# EAGLE board epnet (EAGLE 7.2.0)
EPNET
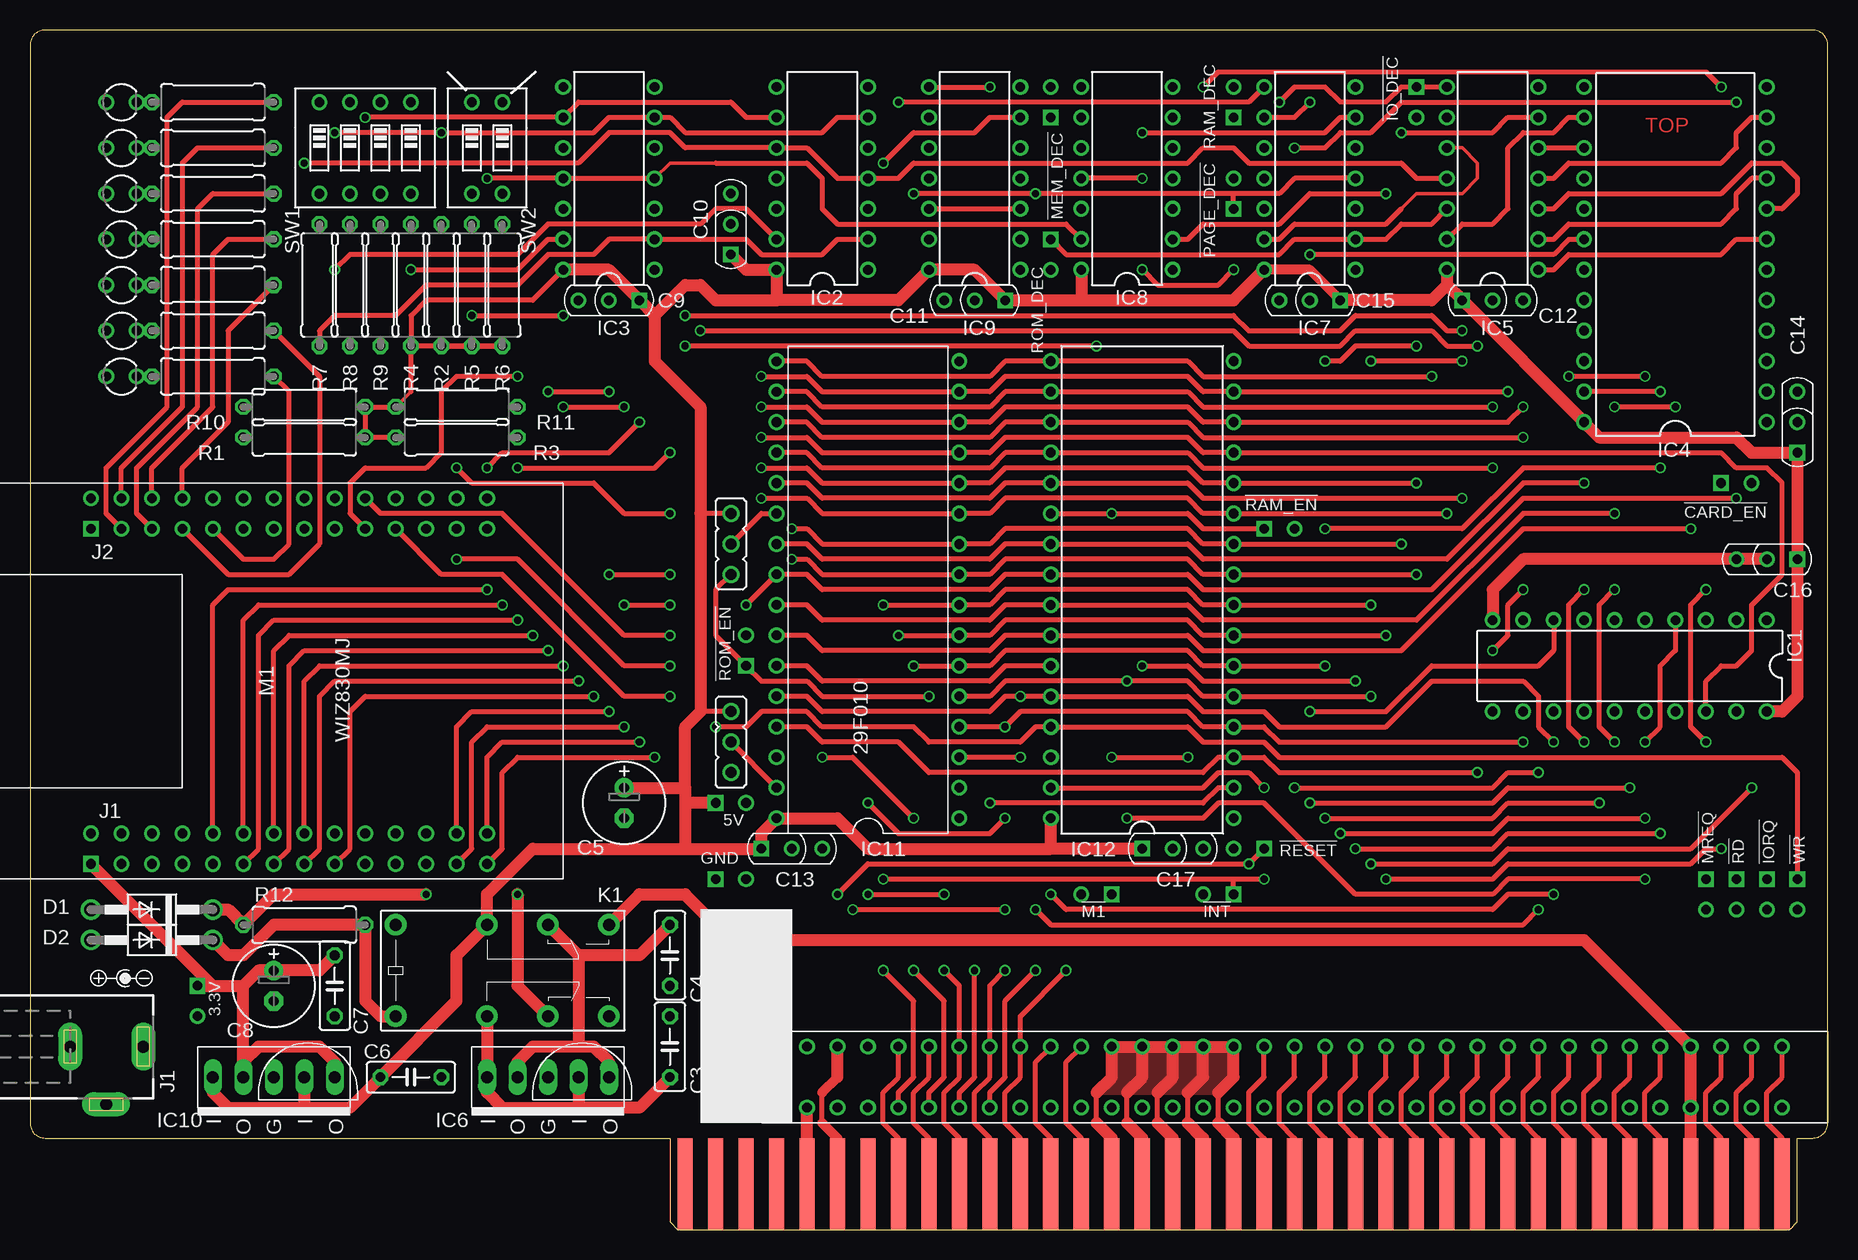
[diagram p1: board, top side]
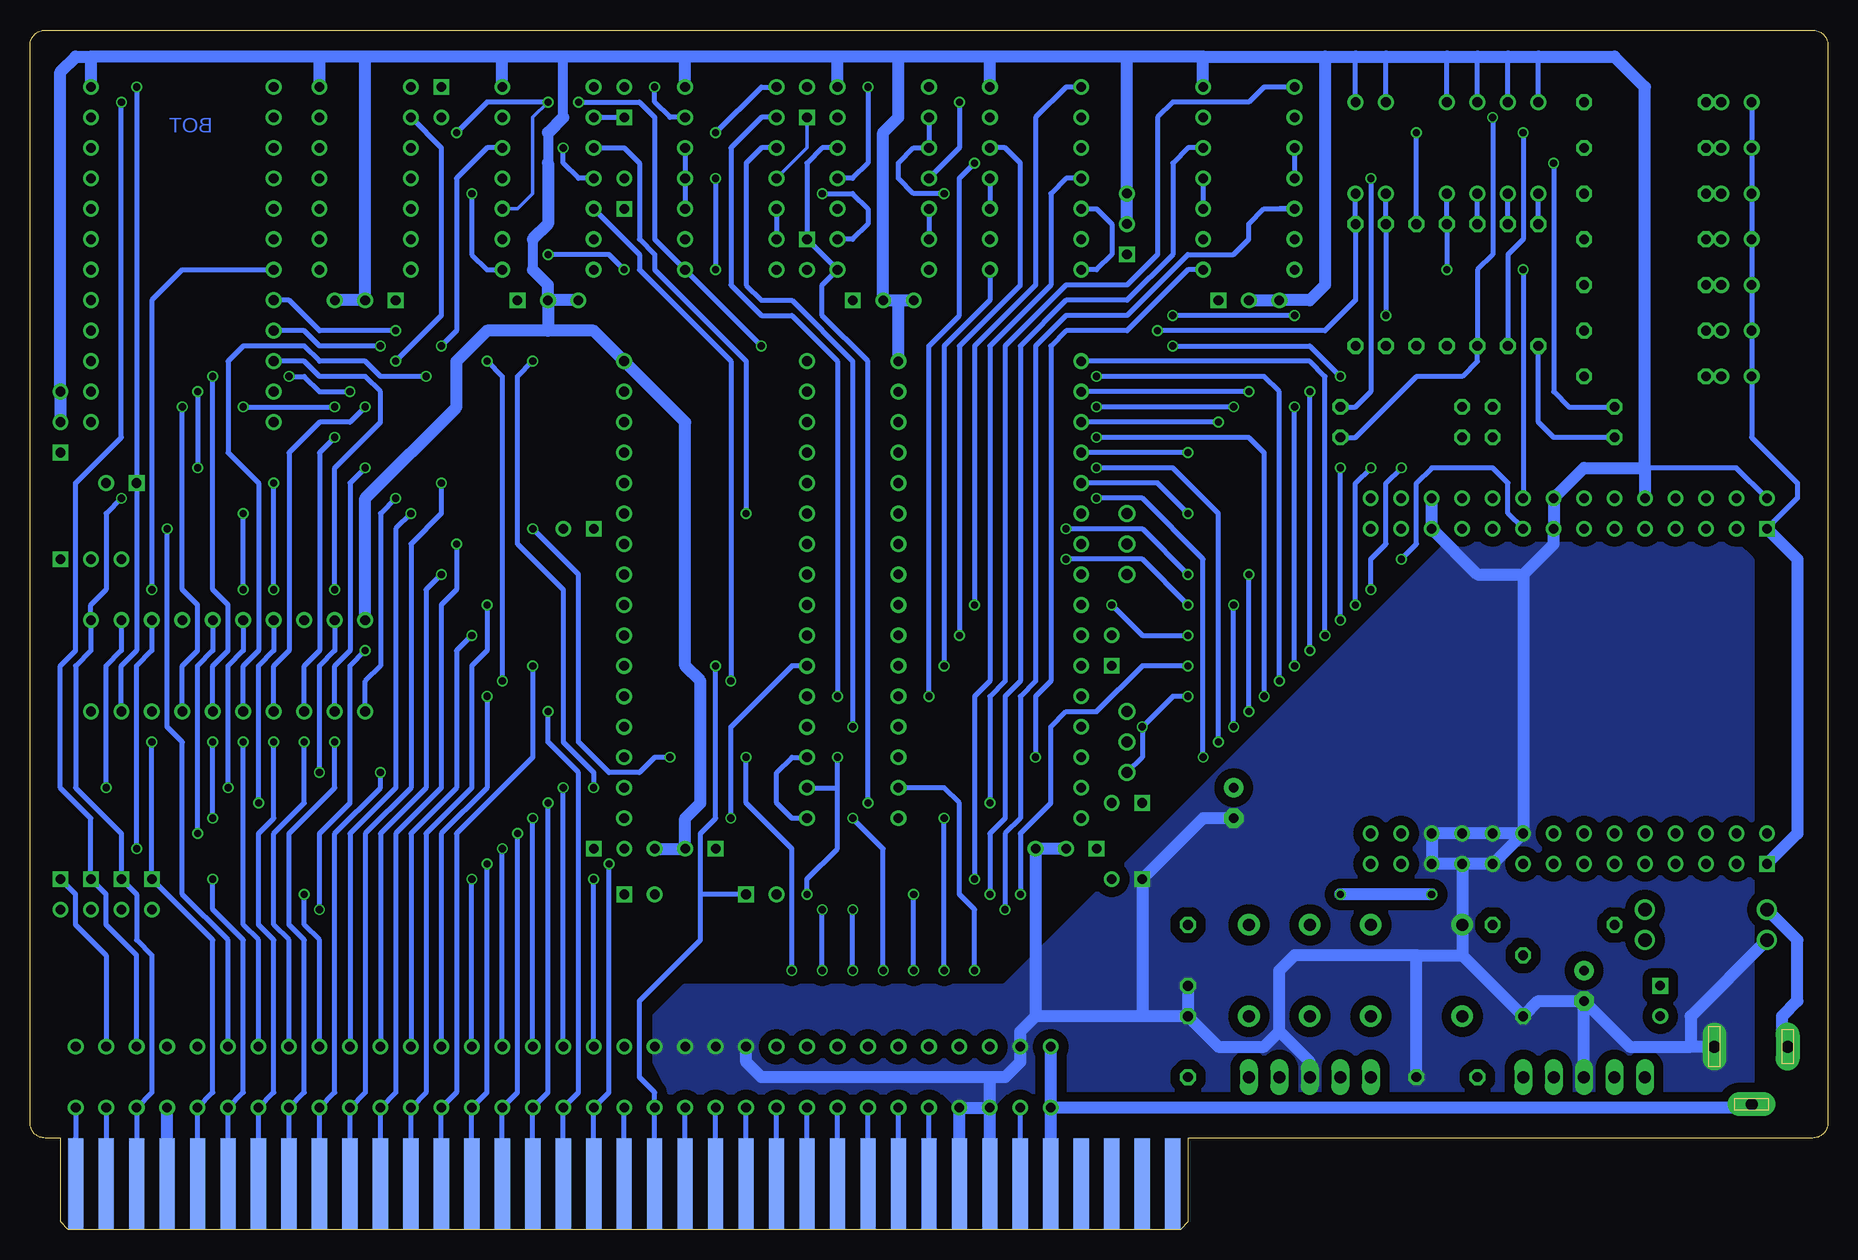
[diagram p2: board, bottom side, seen from below]

Size 149.86 x 100 mm. Coordinates in mm from the lower left corner, seen from the top.
Outline: 53.34,7.62 53.34,0.64 53.98,0 146.69,0 147.3,0.66 147.3,7.62 148.59,7.62 arc90 149.86,8.89 149.86,98.73 arc90 148.57,100 1.27,100 arc90 0,98.73 0,8.89 arc90 1.27,7.62 53.34,7.62
Copper layers (1*16): Top 0.035mm / dielectric 1.5mm / Bottom 0.035mm
Design rules "SeeedStudio_2layer_DRU_no_angle_20140221 *": minimum track width 6mil, minimum drill 12mil, track to track 12mil, track to pad 12mil, pad to pad 12mil, via to via 12mil, smd to smd 0mil, copper to edge 10mil, drill to drill 10mil, minimum pad ring 10mil, minimum via ring 6mil, stop-mask expansion 2mil, vias tented up to drill 100mil, thermal gap 10mil
Net classes: 0 default: clearance 0.205 mm

## Footprints (pad centres in the part's own frame; a part is rotated, then mirrored left to right if it is on the bottom)
CON-EDGE = smd 7.62 x 1.27 bottom: A1 -5.08,-45.72; A2 -5.08,-43.18; A3 -5.08,-40.64; A4 -5.08,-38.1; A5 -5.08,-35.56; A6 -5.08,-33.02; A7 -5.08,-30.48; A8 -5.08,-27.94; A9 -5.08,-25.4; A10 -5.08,-22.86; A11 -5.08,-20.32; A12 -5.08,-17.78; A13 -5.08,-15.24; A14 -5.08,-12.7; A15 -5.08,-10.16; A16 -5.08,-7.62; A17 -5.08,-5.08; A18 -5.08,-2.54; A19 -5.08,0; A20 -5.08,2.54; A21 -5.08,5.08; A22 -5.08,7.62; A23 -5.08,10.16; A24 -5.08,12.7; A25 -5.08,15.24; A26 -5.08,17.78; A27 -5.08,20.32; A28 -5.08,22.86; A29 -5.08,25.4; A30 -5.08,27.94; A31 -5.08,30.48; A32 -5.08,33.02; A33 -5.08,35.56; A34 -5.08,38.1; A35 -5.08,40.64; A36 -5.08,43.18; A37 -5.08,45.72 | smd 7.62 x 1.27: B1 -5.08,-45.72; B2 -5.08,-43.18; B3 -5.08,-40.64; B4 -5.08,-38.1; B5 -5.08,-35.56; B6 -5.08,-33.02; B7 -5.08,-30.48; B8 -5.08,-27.94; B9 -5.08,-25.4; B10 -5.08,-22.86; B11 -5.08,-20.32; B12 -5.08,-17.78; B13 -5.08,-15.24; B14 -5.08,-12.7; B15 -5.08,-10.16; B16 -5.08,-7.62; B17 -5.08,-5.08; B18 -5.08,-2.54; B19 -5.08,0; B20 -5.08,2.54; B21 -5.08,5.08; B22 -5.08,7.62; B23 -5.08,10.16; B24 -5.08,12.7; B25 -5.08,15.24; B26 -5.08,17.78; B27 -5.08,20.32; B28 -5.08,22.86; B29 -5.08,25.4; B30 -5.08,27.94; B31 -5.08,30.48; B32 -5.08,33.02; B33 -5.08,35.56; B34 -5.08,38.1; B35 -5.08,40.64; B36 -5.08,43.18; B37 -5.08,45.72
EXPSOCKET = drill 0.8: A01 -1.27,-40.64; A02 -1.27,-38.1; A03 -1.27,-35.56; A04 -1.27,-33.02; A05 -1.27,-30.48; A06 -1.27,-27.94; A07 -1.27,-25.4; A08 -1.27,-22.86; A09 -1.27,-20.32; A10 -1.27,-17.78; A11 -1.27,-15.24; A12 -1.27,-12.7; A13 -1.27,-10.16; A14 -1.27,-7.62; A15 -1.27,-5.08; A16 -1.27,-2.54; A17 -1.27,0; A18 -1.27,2.54; A19 -1.27,5.08; A20 -1.27,7.62; A21 -1.27,10.16; A22 -1.27,12.7; A23 -1.27,15.24; A24 -1.27,17.78; A25 -1.27,20.32; A26 -1.27,22.86; A27 -1.27,25.4; A28 -1.27,27.94; A29 -1.27,30.48; A30 -1.27,33.02; A31 -1.27,35.56; A32 -1.27,38.1; A33 -1.27,40.64; B01 3.81,-40.64; B02 3.81,-38.1; B03 3.81,-35.56; B04 3.81,-33.02; B05 3.81,-30.48; B06 3.81,-27.94; B07 3.81,-25.4; B08 3.81,-22.86; B09 3.81,-20.32; B10 3.81,-17.78; B11 3.81,-15.24; B12 3.81,-12.7; B13 3.81,-10.16; B14 3.81,-7.62; B15 3.81,-5.08; B16 3.81,-2.54; B17 3.81,0; B18 3.81,2.54; B19 3.81,5.08; B20 3.81,7.62; B21 3.81,10.16; B22 3.81,12.7; B23 3.81,15.24; B24 3.81,17.78; B25 3.81,20.32; B26 3.81,22.86; B27 3.81,25.4; B28 3.81,27.94; B29 3.81,30.48; B30 3.81,33.02; B31 3.81,35.56; B32 3.81,38.1; B33 3.81,40.64
C050-025X075 = drill 0.813 octagon: 1 -2.54,0; 2 2.54,0
E2,5-7 = drill 0.813 pad 1.6: + -1.27,0 | drill 0.813 pad 1.6 octagon: - 1.27,0
CAPACITOR = drill 0.8 square: P$1 -1.27,0 | drill 0.8: P$2 1.27,0; P$3 3.81,0
DO41-10 = drill 1.118: A 5.08,0; C -5.08,0
DIL20 = drill 0.813: 1 -11.43,-3.81; 2 -8.89,-3.81; 3 -6.35,-3.81; 4 -3.81,-3.81; 5 -1.27,-3.81; 6 1.27,-3.81; 7 3.81,-3.81; 8 6.35,-3.81; 9 8.89,-3.81; 10 11.43,-3.81; 11 11.43,3.81; 12 8.89,3.81; 13 6.35,3.81; 14 3.81,3.81; 15 1.27,3.81; 16 -1.27,3.81; 17 -3.81,3.81; 18 -6.35,3.81; 19 -8.89,3.81; 20 -11.43,3.81
DIL14 = drill 0.813: 1 -7.62,-3.81; 2 -5.08,-3.81; 3 -2.54,-3.81; 4 0,-3.81; 5 2.54,-3.81; 6 5.08,-3.81; 7 7.62,-3.81; 8 7.62,3.81; 9 5.08,3.81; 10 2.54,3.81; 11 0,3.81; 12 -2.54,3.81; 13 -5.08,3.81; 14 -7.62,3.81
DIL24-6 = drill 0.813: 1 -13.97,-7.62; 2 -11.43,-7.62; 3 -8.89,-7.62; 4 -6.35,-7.62; 5 -3.81,-7.62; 6 -1.27,-7.62; 7 1.27,-7.62; 8 3.81,-7.62; 9 6.35,-7.62; 10 8.89,-7.62; 11 11.43,-7.62; 12 13.97,-7.62; 13 13.97,7.62; 14 11.43,7.62; 15 8.89,7.62; 16 6.35,7.62; 17 3.81,7.62; 18 1.27,7.62; 19 -1.27,7.62; 20 -3.81,7.62; 21 -6.35,7.62; 22 -8.89,7.62; 23 -11.43,7.62; 24 -13.97,7.62
REGULATOR = drill 1 long: GND -1.27,2.54; IN1 -1.27,5.08; IN2 -1.27,-2.54; OUT1 -1.27,7.62; OUT2 -1.27,0
20F010 = drill 0.8: 1 -7.62,17.78; 2 -7.62,15.24; 3 -7.62,12.7; 4 -7.62,10.16; 5 -7.62,7.62; 6 -7.62,5.08; 7 -7.62,2.54; 8 -7.62,0; 9 -7.62,-2.54; 10 -7.62,-5.08; 11 -7.62,-7.62; 12 -7.62,-10.16; 13 -7.62,-12.7; 14 -7.62,-15.24; 15 -7.62,-17.78; 16 -7.62,-20.32; 17 7.62,-20.32; 18 7.62,-17.78; 19 7.62,-15.24; 20 7.62,-12.7; 21 7.62,-10.16; 22 7.62,-7.62; 23 7.62,-5.08; 24 7.62,-2.54; 25 7.62,0; 26 7.62,2.54; 27 7.62,5.08; 28 7.62,7.62; 29 7.62,10.16; 30 7.62,12.7; 31 7.62,15.24; 32 7.62,17.78
DIL32 = drill 0.813: 1 -19.05,-7.62; 2 -16.51,-7.62; 3 -13.97,-7.62; 4 -11.43,-7.62; 5 -8.89,-7.62; 6 -6.35,-7.62; 7 -3.81,-7.62; 8 -1.27,-7.62; 9 1.27,-7.62; 10 3.81,-7.62; 11 6.35,-7.62; 12 8.89,-7.62; 13 11.43,-7.62; 14 13.97,-7.62; 15 16.51,-7.62; 16 19.05,-7.62; 17 19.05,7.62; 18 16.51,7.62; 19 13.97,7.62; 20 11.43,7.62; 21 8.89,7.62; 22 6.35,7.62; 23 3.81,7.62; 24 1.27,7.62; 25 -1.27,7.62; 26 -3.81,7.62; 27 -6.35,7.62; 28 -8.89,7.62; 29 -11.43,7.62; 30 -13.97,7.62; 31 -16.51,7.62; 32 -19.05,7.62
DCJ0202 = drill 1 pad 2 long: 1 0,3.1; 2 4.8,0; 3 0,-3
JP2 = drill 0.914: 1 -2.54,0; 2 0,0; 3 2.54,0
G5V-2 = drill 1 pad 1.8: 1 -8.89,-3.81; 4 -1.27,-3.81; 6 3.81,-3.81; 8 8.89,-3.81; 9 8.89,3.81; 11 3.81,3.81; 13 -1.27,3.81; 16 -8.89,3.81
LED3MM = drill 0.813: A -1.27,0; K 1.27,0
WIZ830MJ = drill 0.8 square: J1-1 -15.24,17.78; J2-1 12.7,17.78 | drill 0.8: J1-2 -12.7,17.78; J1-3 -15.24,15.24; J1-4 -12.7,15.24; J1-5 -15.24,12.7; J1-6 -12.7,12.7; J1-7 -15.24,10.16; J1-8 -12.7,10.16; J1-9 -15.24,7.62; J1-10 -12.7,7.62; J1-11 -15.24,5.08; J1-12 -12.7,5.08; J1-13 -15.24,2.54; J1-14 -12.7,2.54; J1-15 -15.24,0; J1-16 -12.7,0; J1-17 -15.24,-2.54; J1-18 -12.7,-2.54; J1-19 -15.24,-5.08; J1-20 -12.7,-5.08; J1-21 -15.24,-7.62; J1-22 -12.7,-7.62; J1-23 -15.24,-10.16; J1-24 -12.7,-10.16; J1-25 -15.24,-12.7; J1-26 -12.7,-12.7; J1-27 -15.24,-15.24; J1-28 -12.7,-15.24; J2-2 15.24,17.78; J2-3 12.7,15.24; J2-4 15.24,15.24; J2-5 12.7,12.7; J2-6 15.24,12.7; J2-7 12.7,10.16; J2-8 15.24,10.16; J2-9 12.7,7.62; J2-10 15.24,7.62; J2-11 12.7,5.08; J2-12 15.24,5.08; J2-13 12.7,2.54; J2-14 15.24,2.54; J2-15 12.7,0; J2-16 15.24,0; J2-17 12.7,-2.54; J2-18 15.24,-2.54; J2-19 12.7,-5.08; J2-20 15.24,-5.08; J2-21 12.7,-7.62; J2-22 15.24,-7.62; J2-23 12.7,-10.16; J2-24 15.24,-10.16; J2-25 12.7,-12.7; J2-26 15.24,-12.7; J2-27 12.7,-15.24; J2-28 15.24,-15.24
0309/10 = drill 0.813 octagon: 1 -5.08,0; 2 5.08,0
EDG-04 = drill 0.813: 1 -3.81,-3.81; 2 -1.27,-3.81; 3 1.27,-3.81; 4 3.81,-3.81; 5 3.81,3.81; 6 1.27,3.81; 7 -1.27,3.81; 8 -3.81,3.81
EDG-02 = drill 0.813: 1 -1.27,-3.81; 2 1.27,-3.81; 3 1.27,3.81; 4 -1.27,3.81
TESTPOINT = drill 0.8 square: P$1 0,1.27 | drill 0.8: P$2 0,-1.27

## Placement (x,y rotation side)
C1  Edge Connector  [CON-EDGE]  100.33,8.89 90 top
C2  CON-EXPANSION  [EXPSOCKET]  105.41,11.43 90 top
C3  0.33uF  [C050-025X075]  53.34,15.24 90 top
C4  0.33uF  [C050-025X075]  53.34,22.86 270 top
C5  100uF  [E2,5-7]  49.53,35.56 270 top
C6  0.33uF  [C050-025X075]  31.75,12.7 0 top
C7  0.33uF  [C050-025X075]  25.4,20.32 270 top
C8  100uF  [E2,5-7]  20.32,20.32 270 top
C9  0.1uF  [CAPACITOR]  49.53,77.47 180 top
C10  0.1uF  [CAPACITOR]  58.42,82.55 90 top
C11  0.1uF  [CAPACITOR]  80.01,77.47 180 top
C12  0.1uF  [CAPACITOR]  120.65,77.47 0 top
C13  0.1uF  [CAPACITOR]  62.23,31.75 0 top
C14  1uF  [CAPACITOR]  147.32,66.04 90 top
C15  0.1uF  [CAPACITOR]  107.95,77.47 180 top
C16  0.1uF  [CAPACITOR]  146.05,55.88 180 top
C17  0.1uF  [CAPACITOR]  93.98,31.75 0 top
D1  1N4004  [DO41-10]  10.16,24.13 180 top
D2  1N4004  [DO41-10]  10.16,26.67 180 top
IC1  74HCT245N  [DIL20]  133.35,46.99 180 top
IC2  74LS266N  [DIL14]  66.04,87.63 90 top
IC3  74LS266N  [DIL14]  48.26,87.63 90 top
IC4  74HCT154N  [DIL24-6]  137.16,81.28 90 top
IC5  74AS10N  [DIL14]  121.92,87.63 90 top
IC6  78L05  [REGULATOR]  40.64,11.43 270 top
IC7  74LS02N  [DIL14]  106.68,87.63 90 top
IC8  74LS00N  [DIL14]  91.44,87.63 90 top
IC9  74LS00N  [DIL14]  78.74,87.63 90 top
IC10  LF33CV  [REGULATOR]  17.78,11.43 270 top
IC11  29F010  [20F010]  69.85,52.07 180 top
IC12  AS6C1008  [DIL32]  92.71,53.34 90 top
J1  9V  [DCJ0202]  6.35,15.24 270 top
JP1  WRITE  [JP2]  58.42,57.15 90 top
JP2  ROM  [JP2]  58.42,40.64 90 top
K1  G5V-2  [G5V-2]  39.37,21.59 0 top
LED1  LNK  [LED3MM]  7.62,93.98 0 top
LED2  TX  [LED3MM]  7.62,90.17 0 top
LED3  RX  [LED3MM]  7.62,86.36 0 top
LED4  FDX  [LED3MM]  7.62,74.93 0 top
LED5  100  [LED3MM]  7.62,78.74 0 top
LED6  ACT  [LED3MM]  7.62,71.12 0 top
LED7  COL  [LED3MM]  7.62,82.55 0 top
M1  WIZ830MJ  [WIZ830MJ]  22.86,45.72 90 top
R1  10k  [0309/10]  22.86,66.04 0 top
R2  10k  [0309/10]  34.29,78.74 270 top
R3  10k  [0309/10]  35.56,66.04 180 top
R4  10k  [0309/10]  31.75,78.74 270 top
R5  10k  [0309/10]  36.83,78.74 270 top
R6  10k  [0309/10]  39.37,78.74 270 top
R7  1k  [0309/10]  24.13,78.74 270 top
R8  1k  [0309/10]  26.67,78.74 270 top
R9  1k  [0309/10]  29.21,78.74 270 top
R10  820R  [0309/10]  22.86,68.58 0 top
R11  820R  [0309/10]  35.56,68.58 180 top
R12  [0309/10]  22.86,25.4 180 top
R13  33R  [0309/10]  15.24,93.98 180 top
R14  33R  [0309/10]  15.24,90.17 180 top
R15  33R  [0309/10]  15.24,86.36 180 top
R16  33R  [0309/10]  15.24,74.93 180 top
R17  33R  [0309/10]  15.24,78.74 180 top
R18  33R  [0309/10]  15.24,71.12 180 top
R19  33R  [0309/10]  15.24,82.55 180 top
SW1  ADDR  [EDG-04]  27.94,90.17 180 top
SW2  [EDG-02]  38.1,90.17 180 top
TP1  5V  [TESTPOINT]  58.42,35.56 90 top
TP2  3.3V  [TESTPOINT]  13.97,19.05 0 top
TP3  GND  [TESTPOINT]  58.42,29.21 90 top
TP4  !IO_DEC  [TESTPOINT]  115.57,93.98 0 top
TP5  !MEM_DEC  [TESTPOINT]  85.09,93.98 180 top
TP6  !CARD_EN  [TESTPOINT]  142.24,62.23 90 top
TP7  ROM_DEC  [TESTPOINT]  85.09,81.28 0 top
TP8  RAM_DEC  [TESTPOINT]  100.33,93.98 180 top
TP9  !ROM_EN  [TESTPOINT]  59.69,48.26 180 top
TP10  !RAM_EN  [TESTPOINT]  104.14,58.42 90 top
TP11  !PAGE_DEC  [TESTPOINT]  100.33,86.36 180 top
TP12  !RD  [TESTPOINT]  142.24,27.94 0 top
TP13  !WR  [TESTPOINT]  147.32,27.94 0 top
TP14  !MREQ  [TESTPOINT]  139.7,27.94 0 top
TP15  !IORQ  [TESTPOINT]  144.78,27.94 0 top
TP16  !RESET  [TESTPOINT]  101.6,31.75 270 top
TP17  !INT  [TESTPOINT]  99.06,27.94 270 top
TP18  !M1  [TESTPOINT]  88.9,27.94 270 top

## Tracks (layer width: path | path; a pad name or v marks a point on that pad's centre or on a via)
!CARD_ENABLE  (via drill 0.6)
  Top 0.406: v97.79,95.25 99.06,96.52 139.7,96.52 v140.97,95.25
  Bottom 0.406: IC8.6 96.52,92.71 97.79,93.98 v97.79,95.25 | v140.97,95.25 TP6.P$1 140.97,48.26 142.24,46.99 IC1.19
!EP64  (via drill 0.6)
  Top 0.406: v55.88,74.93 100.33,74.93 101.6,73.66 109.22,73.66 110.49,74.93 116.84,74.93 118.11,73.66 v120.65,73.66
  Bottom 0.406: SW2.4 R6.1 39.37,77.47 41.91,74.93 v55.88,74.93 | v120.65,73.66 125.73,73.66 127,74.93 IC4.21
!INT  (via drill 0.6)
  Top 0.406: C1.B18 102.87,7.62 101.6,8.89 101.6,11.43 102.87,12.7 C2.B18 | v71.12,29.21 100.33,29.21 | 100.33,29.21 v102.87,29.21 | TP17.P$1 100.33,29.21
  Bottom 0.406: IC2.11 63.5,87.63 64.77,86.36 64.77,78.74 69.85,73.66 69.85,45.72 71.12,44.45 v71.12,29.21 | C2.B18 v102.87,29.21
!IO_DECODE  (via drill 0.6)
  Top 0.406: IC5.8 TP4.P$1 114.3,95.25 113.03,93.98 109.22,93.98 107.95,95.25 105.41,95.25 v104.14,93.98 | v88.9,73.66 v54.61,73.66 | v40.64,71.12 35.56,71.12 34.29,69.85 34.29,64.77 33.02,63.5 27.94,63.5 26.67,62.23 26.67,59.69 M1.J2-19
  Bottom 0.406: v104.14,93.98 99.06,93.98 97.79,92.71 97.79,82.55 IC8.1 v88.9,73.66 | v54.61,73.66 43.18,73.66 v40.64,71.12
!IORQ  (via drill 0.6)
  Top 0.406: C1.B3 140.97,7.62 139.7,8.89 139.7,11.43 140.97,12.7 C2.B03 | v105.41,90.17 107.95,90.17 109.22,91.44 111.76,91.44 114.3,93.98 v142.24,93.98
  Bottom 0.406: C2.B03 140.97,22.86 143.51,25.4 143.51,27.94 TP15.P$1 144.78,34.29 147.32,36.83 147.32,46.99 146.05,48.26 146.05,62.23 142.24,66.04 v142.24,93.98 | IC7.11 104.14,87.63 105.41,88.9 v105.41,90.17
!M1  (via drill 0.6)
  Top 0.406: v92.71,46.99 96.52,46.99 97.79,45.72 v110.49,45.72 | v119.38,72.39 v111.76,72.39
  Bottom 0.406: IC5.9 115.57,90.17 115.57,76.2 v119.38,72.39 | v111.76,72.39 110.49,71.12 v110.49,45.72 | 93.98,27.94 93.98,24.13 99.06,19.05 99.06,12.7 97.79,11.43 C2.A20 C1.A20 | 93.98,27.94 93.98,33.02 92.71,34.29 v92.71,46.99 | TP18.P$1 93.98,27.94
!MEM_DEC  (via drill 0.6)
  Top 0.406: v106.68,81.28 127,81.28 128.27,82.55 IC4.18 | v92.71,87.63 IC8.11 | v92.71,80.01 93.98,78.74 99.06,78.74 v100.33,80.01
  Bottom 0.305: IC8.11 85.09,90.17 TP5.P$1
  Bottom 0.406: v92.71,87.63 v92.71,80.01 | v100.33,80.01 101.6,81.28 v106.68,81.28
!MREQ  (via drill 0.6)
  Top 0.406: v139.7,40.64 138.43,41.91 138.43,52.07 v139.7,53.34
  Bottom 0.406: v139.7,53.34 139.7,77.47 137.16,80.01 IC4.19 | v139.7,40.64 TP14.P$1 134.62,24.13 134.62,11.43 C2.A05 C1.A5
!RAM_ENABLE  (via drill 0.6)
  Top 0.406: TP10.P$1 97.79,58.42 96.52,59.69 v90.17,59.69 IC12.22
  Bottom 0.406: IC7.10 100.33,90.17 99.06,88.9 99.06,82.55 97.79,81.28 97.79,80.01 90.17,72.39 v90.17,59.69
!RD  (via drill 0.6)
  Top 0.406: v142.24,60.96 124.46,60.96 116.84,53.34 97.79,53.34 96.52,54.61 IC12.24 81.28,54.61 80.01,53.34 66.04,53.34 64.77,54.61 IC11.24 v59.69,52.07 | v53.34,49.53 49.53,49.53 39.37,59.69 29.21,59.69 M1.J2-20
  Bottom 0.406: v142.24,60.96 143.51,59.69 143.51,53.34 144.78,52.07 IC1.1 144.78,48.26 146.05,46.99 146.05,36.83 142.24,33.02 TP12.P$1 140.97,27.94 140.97,24.13 139.7,22.86 139.7,11.43 C2.A03 C1.A3 | v59.69,52.07 57.15,49.53 v53.34,49.53
!RESET  (via drill 0.6)
  Top 0.406: v53.34,46.99 49.53,46.99 40.64,55.88 v35.56,55.88 | v67.31,27.94 69.85,30.48 v101.6,30.48 TP16.P$1
  Bottom 0.406: v101.6,30.48 101.6,11.43 C2.A18 C1.A18 | v35.56,55.88 34.29,57.15 34.29,62.23 33.02,63.5 27.94,63.5 26.67,62.23 26.67,59.69 M1.J2-17 | v53.34,46.99 57.15,46.99 60.96,43.18 63.5,43.18 64.77,41.91 64.77,35.56 67.31,33.02 v67.31,27.94
!ROM_ENABLE  (via drill 0.6)
  Top 0.406: v71.12,88.9 73.66,91.44 78.74,91.44 80.01,92.71 IC9.6 | v74.93,44.45 66.04,44.45 64.77,45.72 60.96,45.72 TP9.P$1 57.15,49.53 57.15,53.34 JP1.1
  Bottom 0.406: v74.93,44.45 74.93,73.66 72.39,76.2 72.39,87.63 v71.12,88.9
!WR  (via drill 0.6)
  Top 0.406: C1.B2 143.51,7.62 142.24,8.89 142.24,11.43 143.51,12.7 C2.B02 | v57.15,41.91 59.69,41.91 60.96,43.18 64.77,43.18 66.04,41.91 73.66,41.91 74.93,40.64 82.55,40.64 83.82,41.91 IC12.29 96.52,41.91 97.79,40.64 102.87,40.64 104.14,39.37 146.05,39.37 147.32,38.1 TP13.P$1 | v53.34,44.45 49.53,44.45 39.37,54.61 34.29,54.61 M1.J2-21
  Bottom 0.406: JP2.1 57.15,39.37 v57.15,41.91 54.61,44.45 v53.34,44.45 | C2.B02 143.51,22.86 146.05,25.4 146.05,27.94 TP13.P$1
+3V3
  Top 1.016: IC10.OUT1 25.4,13.97 24.13,15.24 19.05,15.24 17.78,13.97 | IC10.OUT2 17.78,13.97 | 17.78,20.32 19.05,21.59 C8.+ 24.13,21.59 C7.1 | M1.J1-1 15.24,20.32 | 17.78,13.97 17.78,20.32 | 15.24,20.32 17.78,20.32 | TP2.P$1 15.24,20.32
  Bottom 0.406: M1.J2-1 2.54,60.96 2.54,62.23 6.35,66.04 LED6.A LED4.A LED5.A LED7.A LED3.A LED2.A LED1.A
  Bottom 1.016: M1.J2-1 2.54,55.88 2.54,33.02 M1.J1-1
A0  (via drill 0.6)
  Top 0.406: M1.J1-28 38.1,39.37 39.37,40.64 v50.8,40.64 | v60.96,63.5 64.77,63.5 66.04,62.23 IC11.12 80.01,62.23 81.28,63.5 96.52,63.5 97.79,62.23 IC12.12 v115.57,62.23
  Bottom 0.406: v50.8,40.64 50.8,59.69 54.61,63.5 v60.96,63.5 | v115.57,62.23 115.57,59.69 118.11,57.15 118.11,36.83 121.92,33.02 121.92,11.43 C2.A10 C1.A10
A1  (via drill 0.6)
  Top 0.406: C1.B10 123.19,7.62 121.92,8.89 121.92,11.43 123.19,12.7 C2.B10 | M1.J1-27 39.37,31.75 39.37,38.1 40.64,39.37 v52.07,39.37 | v60.96,60.96 64.77,60.96 66.04,59.69 IC11.11 80.01,59.69 81.28,60.96 96.52,60.96 97.79,59.69 IC12.11 v118.11,59.69
  Bottom 0.406: v52.07,39.37 52.07,55.88 57.15,60.96 v60.96,60.96 | v118.11,59.69 119.38,58.42 119.38,36.83 123.19,33.02 C2.B10
A2  (via drill 0.6)
  Top 0.406: M1.J1-26 35.56,41.91 36.83,43.18 v48.26,43.18 | v48.26,54.61 v53.34,54.61 | v63.5,58.42 64.77,58.42 66.04,57.15 IC11.10 80.01,57.15 81.28,58.42 96.52,58.42 97.79,57.15 IC12.10 v114.3,57.15
  Bottom 0.406: v48.26,43.18 v48.26,54.61 | v114.3,57.15 114.3,53.34 115.57,52.07 115.57,36.83 119.38,33.02 119.38,11.43 C2.A11 C1.A11 | v63.5,58.42 57.15,58.42 v53.34,54.61
A3  (via drill 0.6)
  Top 0.406: C1.B11 120.65,7.62 119.38,8.89 119.38,11.43 120.65,12.7 C2.B11 | M1.J1-25 36.83,31.75 36.83,40.64 38.1,41.91 v49.53,41.91 | v49.53,52.07 v53.34,52.07 | v115.57,54.61 IC12.9 97.79,54.61 96.52,55.88 81.28,55.88 80.01,54.61 IC11.9 66.04,54.61 64.77,55.88 v63.5,55.88
  Bottom 0.406: v49.53,41.91 v49.53,52.07 | v53.34,52.07 57.15,55.88 v63.5,55.88 | v115.57,54.61 116.84,53.34 116.84,36.83 120.65,33.02 C2.B11
A4  (via drill 0.6)
  Top 0.406: v71.12,52.07 IC11.8 80.01,52.07 81.28,53.34 96.52,53.34 97.79,52.07 IC12.8 v111.76,52.07
  Bottom 0.406: v111.76,52.07 111.76,48.26 113.03,46.99 113.03,36.83 116.84,33.02 116.84,11.43 C2.A12 C1.A12 | IC2.8 63.5,95.25 66.04,92.71 66.04,78.74 71.12,73.66 v71.12,52.07
A5  (via drill 0.6)
  Top 0.406: C1.B12 118.11,7.62 116.84,8.89 116.84,11.43 118.11,12.7 C2.B12 | v72.39,49.53 IC11.7 80.01,49.53 81.28,50.8 96.52,50.8 97.79,49.53 IC12.7 v113.03,49.53
  Bottom 0.406: v113.03,49.53 114.3,48.26 114.3,36.83 118.11,33.02 C2.B12 | v72.39,49.53 72.39,73.66 67.31,78.74 67.31,88.9 68.58,90.17 IC2.5
A6  (via drill 0.6)
  Top 0.406: v73.66,46.99 IC11.6 80.01,46.99 81.28,48.26 96.52,48.26 97.79,46.99 IC12.6 v107.95,46.99
  Bottom 0.406: v107.95,46.99 107.95,39.37 114.3,33.02 114.3,11.43 C2.A13 C1.A13 | IC2.1 69.85,77.47 73.66,73.66 v73.66,46.99
A7  (via drill 0.6)
  Top 0.406: C1.B13 115.57,7.62 114.3,8.89 114.3,11.43 115.57,12.7 C2.B13 | IC11.5 80.01,44.45 81.28,45.72 v91.44,45.72 96.52,45.72 97.79,44.45 IC12.5 v111.76,44.45
  Bottom 0.406: v111.76,44.45 111.76,36.83 115.57,33.02 C2.B13 | IC7.12 99.06,81.28 99.06,80.01 91.44,72.39 v91.44,45.72
A8  (via drill 0.6)
  Top 0.406: IC11.27 64.77,46.99 66.04,45.72 80.01,45.72 81.28,46.99 IC12.27 | v134.62,29.21 123.19,29.21 121.92,27.94 110.49,27.94 102.87,35.56 99.06,35.56 97.79,34.29 v91.44,34.29
  Bottom 0.406: v134.62,29.21 134.62,26.67 132.08,24.13 132.08,11.43 C2.A06 C1.A6 | v91.44,34.29 91.44,41.91 86.36,46.99 IC12.27
A9  (via drill 0.6)
  Top 0.406: C1.B6 133.35,7.62 132.08,8.89 132.08,11.43 133.35,12.7 C2.B06 | IC11.26 64.77,49.53 66.04,48.26 80.01,48.26 81.28,49.53 IC12.26 96.52,49.53 97.79,48.26 114.3,48.26 124.46,58.42 v138.43,58.42
  Bottom 0.406: C2.B06 133.35,24.13 137.16,27.94 137.16,40.64 138.43,41.91 v138.43,58.42
A10  (via drill 0.6)
  Top 0.406: IC11.23 64.77,57.15 66.04,55.88 80.01,55.88 81.28,57.15 IC12.23 96.52,57.15 97.79,55.88 118.11,55.88 124.46,62.23 v129.54,62.23 | v129.54,40.64 128.27,41.91 128.27,52.07 v129.54,53.34
  Bottom 0.406: v129.54,40.64 129.54,34.29 130.81,33.02 130.81,25.4 129.54,24.13 129.54,11.43 C2.A07 C1.A7 | v129.54,53.34 v129.54,62.23
A11  (via drill 0.6)
  Top 0.406: C1.B7 130.81,7.62 129.54,8.89 129.54,11.43 130.81,12.7 C2.B07 | IC11.25 64.77,52.07 66.04,50.8 80.01,50.8 81.28,52.07 IC12.25 96.52,52.07 97.79,50.8 115.57,50.8 124.46,59.69 v132.08,59.69 | v132.08,40.64 130.81,41.91 130.81,52.07 v132.08,53.34
  Bottom 0.406: C2.B07 130.81,24.13 132.08,25.4 v132.08,40.64 | v132.08,53.34 v132.08,59.69
A12  (via drill 0.6)
  Top 0.406: IC11.4 v81.28,41.91 82.55,43.18 96.52,43.18 97.79,41.91 IC12.4 102.87,41.91 104.14,40.64 v124.46,40.64
  Bottom 0.406: v124.46,40.64 124.46,36.83 128.27,33.02 128.27,25.4 127,24.13 127,11.43 C2.A08 C1.A8 | IC8.10 88.9,90.17 90.17,88.9 90.17,78.74 88.9,77.47 86.36,77.47 81.28,72.39 v81.28,41.91
A13  (via drill 0.6)
  Top 0.406: C1.B8 128.27,7.62 127,8.89 127,11.43 128.27,12.7 C2.B08 | IC11.28 64.77,44.45 66.04,43.18 80.01,43.18 81.28,44.45 v82.55,44.45 IC12.28 96.52,44.45 97.79,43.18 102.87,43.18 104.14,41.91 113.03,41.91 116.84,45.72 124.46,45.72 125.73,44.45 125.73,41.91 v127,40.64
  Bottom 0.406: C2.B08 128.27,24.13 129.54,25.4 129.54,33.02 127,35.56 v127,40.64 | IC8.9 88.9,92.71 91.44,90.17 91.44,78.74 88.9,76.2 86.36,76.2 82.55,72.39 v82.55,44.45
A14  (via drill 0.6)
  Top 0.406: IC11.29 64.77,41.91 66.04,40.64 72.39,40.64 74.93,38.1 97.79,38.1 99.06,39.37 IC12.3 102.87,39.37 104.14,38.1 v120.65,38.1
  Bottom 0.406: v120.65,38.1 120.65,36.83 124.46,33.02 124.46,11.43 C2.A09 C1.A9
A15  (via drill 0.6)
  Top 0.406: C1.B9 125.73,7.62 124.46,8.89 124.46,11.43 125.73,12.7 C2.B09 | v82.55,39.37 IC11.3 | v127,27.94 123.19,27.94 121.92,26.67 86.36,26.67 v85.09,27.94 | v102.87,36.83 101.6,38.1 99.06,38.1 97.79,36.83 IC12.31 | v115.57,73.66 110.49,73.66 109.22,72.39 v107.95,72.39
  Bottom 0.406: C2.B09 125.73,24.13 127,25.4 v127,27.94 | v85.09,27.94 85.09,29.21 82.55,31.75 82.55,36.83 | 82.55,36.83 v82.55,39.37 | IC7.5 111.76,90.17 114.3,87.63 114.3,74.93 v115.57,73.66 | v102.87,36.83 102.87,38.1 105.41,40.64 105.41,53.34 109.22,57.15 109.22,71.12 v107.95,72.39 | IC12.31 82.55,36.83
A16  (via drill 0.6)
  Top 0.406: v86.36,21.59 82.55,17.78 C2.B26 82.55,12.7 81.28,11.43 81.28,8.89 82.55,7.62 C1.B26 | v90.17,39.37 v96.52,39.37 | v135.89,63.5 124.46,63.5 119.38,58.42 v107.95,58.42 | v135.89,69.85 IC4.23
  Bottom 0.406: v86.36,21.59 86.36,31.75 90.17,35.56 v90.17,39.37 | v96.52,39.37 97.79,39.37 99.06,38.1 101.6,38.1 104.14,40.64 104.14,54.61 v107.95,58.42 | v135.89,69.85 v135.89,63.5
A17  (via drill 0.6)
  Top 0.406: C2.A27 80.01,11.43 81.28,12.7 81.28,19.05 v83.82,21.59 | v83.82,26.67 85.09,25.4 124.46,25.4 v125.73,26.67 | v121.92,48.26 123.19,49.53 123.19,52.07 v124.46,53.34
  Bottom 0.406: v83.82,21.59 v83.82,26.67 | C1.A27 C2.A27 | v125.73,26.67 125.73,33.02 123.19,35.56 123.19,46.99 v121.92,48.26 | v124.46,53.34 124.46,63.5 120.65,67.31 120.65,69.85 121.92,71.12 125.73,71.12 127,72.39 IC4.22
A18  (via drill 0.6)
  Top 0.406: v81.28,21.59 80.01,20.32 C2.B27 80.01,12.7 78.74,11.43 78.74,8.89 80.01,7.62 C1.B27 | v68.58,26.67 v81.28,26.67
  Bottom 0.406: 45.72,85.09 IC3.12 46.99,85.09 48.26,83.82 48.26,82.55 49.53,81.28 53.34,81.28 58.42,76.2 63.5,76.2 66.04,73.66 66.04,45.72 67.31,44.45 67.31,34.29 68.58,33.02 v68.58,26.67 | v81.28,21.59 v81.28,26.67
A19  (via drill 0.6)
  Top 0.406: C2.A28 77.47,11.43 78.74,12.7 v78.74,21.59 | v69.85,35.56 72.39,33.02 80.01,33.02 v81.28,34.29
  Bottom 0.406: IC3.8 46.99,95.25 48.26,93.98 54.61,93.98 55.88,92.71 55.88,81.28 58.42,78.74 63.5,78.74 68.58,73.66 68.58,45.72 69.85,44.45 v69.85,35.56 | v78.74,21.59 78.74,31.75 v81.28,34.29 | C1.A28 C2.A28
A20  (via drill 0.6)
  Top 0.406: v76.2,21.59 77.47,20.32 C2.B28 77.47,12.7 76.2,11.43 76.2,8.89 77.47,7.62 C1.B28 | v69.85,27.94 v76.2,27.94
  Bottom 0.406: IC3.5 53.34,90.17 54.61,88.9 54.61,81.28 58.42,77.47 63.5,77.47 67.31,73.66 67.31,45.72 68.58,44.45 68.58,34.29 69.85,33.02 v69.85,27.94 | v76.2,21.59 v76.2,27.94
A21  (via drill 0.6)
  Top 0.406: C2.A29 74.93,11.43 76.2,12.7 76.2,19.05 v73.66,21.59 | v66.04,39.37 68.58,39.37 v73.66,34.29
  Bottom 0.406: IC3.1 53.34,80.01 58.42,74.93 63.5,74.93 64.77,73.66 64.77,45.72 66.04,44.45 v66.04,39.37 | v73.66,21.59 v73.66,34.29 | C1.A29 C2.A29
BD0  (via drill 0.6)
  Top 0.406: M1.J1-17 26.67,31.75 26.67,43.18 27.94,44.45 v46.99,44.45 | v60.96,66.04 64.77,66.04 66.04,64.77 IC11.13 80.01,64.77 81.28,66.04 96.52,66.04 97.79,64.77 IC12.13 140.97,64.77 142.24,63.5 144.78,63.5 146.05,62.23 146.05,54.61 143.51,52.07 143.51,48.26 142.24,46.99 140.97,46.99 139.7,45.72 IC1.18
  Bottom 0.406: v60.96,66.04 48.26,66.04 46.99,64.77 v46.99,44.45
BD1  (via drill 0.6)
  Top 0.406: M1.J1-16 22.86,45.72 24.13,46.99 v44.45,46.99 | v44.45,68.58 v49.53,68.58 | v60.96,68.58 64.77,68.58 66.04,67.31 IC11.14 80.01,67.31 81.28,68.58 96.52,68.58 97.79,67.31 IC12.14 123.19,67.31 v124.46,68.58 | v137.16,68.58 v132.08,68.58
  Bottom 0.406: v44.45,46.99 v44.45,68.58 | v49.53,68.58 v60.96,68.58 | v137.16,68.58 137.16,53.34 135.89,52.07 135.89,48.26 137.16,46.99 IC1.17 | v132.08,68.58 v124.46,68.58
BD2  (via drill 0.6)
  Top 0.406: M1.J1-15 24.13,31.75 24.13,44.45 25.4,45.72 v45.72,45.72 | v60.96,71.12 64.77,71.12 66.04,69.85 IC11.15 80.01,69.85 81.28,71.12 96.52,71.12 97.79,69.85 IC12.15 v123.19,69.85 | v134.62,71.12 v128.27,71.12
  Bottom 0.406: v45.72,45.72 45.72,69.85 46.99,71.12 v60.96,71.12 | v134.62,71.12 134.62,53.34 133.35,52.07 133.35,48.26 134.62,46.99 IC1.16 | v128.27,71.12 127,71.12 125.73,69.85 v123.19,69.85
BD3  (via drill 0.6)
  Top 0.406: IC11.17 64.77,72.39 66.04,71.12 80.01,71.12 81.28,72.39 IC12.17 96.52,72.39 97.79,71.12 v116.84,71.12 | M1.J1-14 20.32,48.26 21.59,49.53 v41.91,49.53
  Bottom 0.406: v41.91,49.53 41.91,71.12 43.18,72.39 IC11.17 | v116.84,71.12 120.65,71.12 121.92,72.39 125.73,72.39 127,73.66 132.08,73.66 133.35,72.39 133.35,64.77 130.81,62.23 130.81,48.26 132.08,46.99 IC1.15
BD4  (via drill 0.6)
  Top 0.406: IC11.18 64.77,69.85 66.04,68.58 80.01,68.58 81.28,69.85 IC12.18 96.52,69.85 97.79,68.58 v121.92,68.58 | M1.J1-13 21.59,31.75 21.59,46.99 22.86,48.26 v43.18,48.26 | v43.18,69.85 v48.26,69.85
  Bottom 0.406: v43.18,48.26 v43.18,69.85 | v48.26,69.85 IC11.18 | v121.92,68.58 123.19,67.31 125.73,67.31 128.27,64.77 128.27,48.26 129.54,46.99 IC1.14
BD5  (via drill 0.6)
  Top 0.406: IC11.19 64.77,67.31 66.04,66.04 80.01,66.04 81.28,67.31 IC12.19 96.52,67.31 97.79,66.04 v124.46,66.04 | M1.J1-12 17.78,50.8 19.05,52.07 v39.37,52.07 | v38.1,63.5 39.37,64.77 48.26,64.77 v50.8,67.31
  Bottom 0.406: v39.37,52.07 39.37,62.23 v38.1,63.5 | v50.8,67.31 IC11.19 | v124.46,66.04 125.73,64.77 125.73,48.26 127,46.99 IC1.13
BD6  (via drill 0.6)
  Top 0.406: IC11.20 64.77,64.77 66.04,63.5 80.01,63.5 81.28,64.77 IC12.20 96.52,64.77 97.79,63.5 v121.92,63.5 | M1.J1-11 19.05,31.75 19.05,49.53 20.32,50.8 v40.64,50.8 | v40.64,63.5 52.07,63.5 v53.34,64.77
  Bottom 0.406: v40.64,50.8 v40.64,63.5 | v53.34,64.77 IC11.20 | v121.92,63.5 123.19,62.23 123.19,48.26 124.46,46.99 IC1.12
BD7  (via drill 0.6)
  Top 0.406: IC11.21 64.77,62.23 66.04,60.96 80.01,60.96 81.28,62.23 IC12.21 96.52,62.23 97.79,60.96 v119.38,60.96 | M1.J1-10 15.24,52.07 16.51,53.34 v38.1,53.34 | v35.56,63.5 36.83,62.23 46.99,62.23 49.53,59.69 v53.34,59.69
  Bottom 0.406: v38.1,53.34 38.1,55.88 36.83,57.15 36.83,62.23 v35.56,63.5 | v53.34,59.69 55.88,62.23 IC11.21 | v119.38,60.96 120.65,59.69 120.65,46.99 121.92,45.72 IC1.11
D0  (via drill 0.6)
  Top 0.406: v111.76,30.48 121.92,30.48 123.19,31.75 138.43,31.75 v143.51,36.83
  Bottom 0.406: v111.76,30.48 111.76,11.43 C2.A14 C1.A14 | v143.51,36.83 143.51,46.99 142.24,48.26 IC1.2
D1  (via drill 0.6)
  Top 0.406: C1.B14 113.03,7.62 111.76,8.89 111.76,11.43 113.03,12.7 C2.B14 | v113.03,29.21 121.92,29.21 123.19,30.48 138.43,30.48 139.7,31.75 v140.97,31.75
  Bottom 0.406: C2.B14 v113.03,29.21 | v140.97,31.75 140.97,46.99 139.7,48.26 IC1.3
D2  (via drill 0.6)
  Top 0.406: v109.22,33.02 121.92,33.02 123.19,34.29 v134.62,34.29 | v134.62,40.64 135.89,41.91 135.89,46.99 137.16,48.26 IC1.4
  Bottom 0.406: v109.22,33.02 109.22,11.43 C2.A15 C1.A15 | v134.62,34.29 v134.62,40.64
D3  (via drill 0.6)
  Top 0.406: C1.B15 110.49,7.62 109.22,8.89 109.22,11.43 110.49,12.7 C2.B15 | v110.49,31.75 121.92,31.75 123.19,33.02 v135.89,33.02
  Bottom 0.406: C2.B15 v110.49,31.75 | v135.89,33.02 135.89,46.99 134.62,48.26 IC1.5
D4  (via drill 0.6)
  Top 0.406: v106.68,35.56 121.92,35.56 123.19,36.83 v133.35,36.83
  Bottom 0.406: v106.68,35.56 106.68,11.43 C2.A16 C1.A16 | v133.35,36.83 133.35,46.99 132.08,48.26 IC1.6
D5  (via drill 0.6)
  Top 0.406: C1.B16 107.95,7.62 106.68,8.89 106.68,11.43 107.95,12.7 C2.B16 | v107.95,34.29 121.92,34.29 123.19,35.56 v130.81,35.56
  Bottom 0.406: C2.B16 v107.95,34.29 | v130.81,35.56 130.81,46.99 129.54,48.26 IC1.7
D6  (via drill 0.6)
  Top 0.406: v106.68,43.18 113.03,43.18 116.84,46.99 125.73,46.99 127,48.26 IC1.8
  Bottom 0.406: v106.68,43.18 106.68,40.64 104.14,38.1 104.14,11.43 C2.A17 C1.A17
D7  (via drill 0.6)
  Top 0.406: C1.B17 105.41,7.62 104.14,8.89 104.14,11.43 105.41,12.7 C2.B17 | v105.41,36.83 121.92,36.83 123.19,38.1 v125.73,38.1
  Bottom 0.406: C2.B17 v105.41,36.83 | v125.73,38.1 125.73,46.99 124.46,48.26 IC1.9
GND  (via drill 0.6)
  Top 0.406: C2.A30 72.39,11.43 73.66,12.7 73.66,19.05 v71.12,21.59 | C1.B19 100.33,7.62 | 99.06,8.89 99.06,11.43 | C1.B20 97.79,7.62 | 96.52,8.89 96.52,11.43 | C1.B21 95.25,7.62 | 93.98,8.89 93.98,11.43 | C1.B22 92.71,7.62 | 91.44,8.89 91.44,11.43 | C1.B23 90.17,7.62 | 88.9,8.89 88.9,11.43 | 66.04,8.89 66.04,11.43
  Top 0.813: C1.B32 67.31,7.62 66.04,8.89 | 66.04,11.43 67.31,12.7
  Top 1.016: C2.B22 C2.B23 90.17,12.7 88.9,11.43 | C2.B22 C2.B21 | C2.B21 C2.B20 | C2.B20 C2.B19 100.33,12.7 99.06,11.43 | 91.44,11.43 92.71,12.7 C2.B22 | 93.98,11.43 95.25,12.7 C2.B21 | 96.52,11.43 97.79,12.7 C2.B20 | 90.17,7.62 88.9,8.89 | 92.71,7.62 91.44,8.89 | 95.25,7.62 93.98,8.89 | 97.79,7.62 96.52,8.89 | 100.33,7.62 99.06,8.89 | 67.31,12.7 C2.B32 | C16.P$3 C16.P$2 124.46,55.88 121.92,53.34 IC1.10
  Bottom 0.406: v71.12,21.59 71.12,26.67 72.39,27.94 72.39,35.56 73.66,36.83 IC11.2 | M1.J2-2 7.62,63.5 15.24,63.5 | SW1.4 24.13,97.79 | SW1.3 26.67,97.79 | SW1.2 29.21,97.79 | SW1.1 31.75,97.79 | SW2.2 36.83,97.79 | SW2.1 39.37,97.79
  Bottom 0.813: C1.A31 C2.A31 | 107.95,82.55 107.95,80.01 | 105.41,92.71 105.41,97.79 | 106.68,91.44 106.68,88.9
  Bottom 1.016: 25.4,54.61 22.86,57.15 M1.J2-15 M1.J2-16 20.32,63.5 15.24,63.5 | 25.4,54.61 29.21,54.61 M1.J2-23 M1.J2-24 | 25.4,54.61 M1.J1-18 | M1.J1-18 M1.J1-19 M1.J1-21 | 15.24,63.5 15.24,95.25 17.78,97.79 24.13,97.79 26.67,97.79 29.21,97.79 31.75,97.79 36.83,97.79 39.37,97.79 41.91,97.79 | 52.07,97.79 58.42,97.79 | 58.42,97.79 69.85,97.79 | 69.85,97.79 77.47,97.79 | 77.47,97.79 82.55,97.79 | 82.55,97.79 95.25,97.79 | 95.25,97.79 105.41,97.79 110.49,97.79 | 110.49,97.79 121.92,97.79 | 121.92,97.79 125.73,97.79 | 125.73,97.79 144.78,97.79 | 144.78,97.79 IC4.12 | IC2.7 69.85,97.79 | IC9.7 82.55,97.79 | IC8.7 95.25,97.79 | IC3.7 52.07,97.79 | 77.47,97.79 77.47,92.71 78.74,91.44 C11.P$2 77.47,77.47 | IC5.7 125.73,97.79 | IC1.10 121.92,60.96 114.3,68.58 114.3,72.39 111.76,74.93 106.68,74.93 | 52.07,97.79 41.91,97.79 | 77.47,77.47 C11.P$3 | 58.42,97.79 C10.P$3 C10.P$2 | 121.92,97.79 C12.P$2 C12.P$3 | 144.78,97.79 146.05,97.79 147.32,96.52 C14.P$3 C14.P$2 | C9.P$2 C9.P$3 43.18,77.47 41.91,78.74 41.91,97.79 | C13.P$2 C13.P$3 66.04,17.78 | C1.A30 C2.A30 C2.A31 | C1.A31 69.85,12.7 | IC7.7 110.49,97.79 | 106.68,74.93 102.87,74.93 IC12.16 95.25,67.31 95.25,46.99 93.98,45.72 93.98,35.56 95.25,34.29 C17.P$2 C17.P$3 | 105.41,92.71 106.68,91.44 | 107.95,82.55 106.68,83.82 106.68,88.9 | IC10.GND C8.- | IC6.GND 43.18,13.97 45.72,16.51 | 45.72,16.51 45.72,21.59 44.45,22.86 34.29,22.86 | C6.2 34.29,22.86 | 34.29,22.86 30.48,22.86 | 30.48,22.86 K1.16 M1.J1-21 | C3.2 50.8,15.24 46.99,15.24 45.72,16.51 | C5.- 52.07,34.29 TP3.P$1 57.15,17.78 | C3.2 57.15,17.78 | 57.15,17.78 66.04,17.78 | 66.04,17.78 67.31,16.51 C2.B32 67.31,13.97 68.58,12.7 69.85,12.7
  Bottom 1.016: C4.2 C3.2 | M1.J1-18 M1.J1-20 M1.J1-22 M1.J1-24 M1.J1-23 M1.J1-21 | 69.85,12.7 88.9,12.7 90.17,13.97 C2.B23 | 15.24,63.5 M1.J2-10 | C8.- 24.13,19.05 C7.2 30.48,22.86 | 11.43,15.24 16.51,15.24 C8.- | IC11.16 77.47,77.47 | C15.P$2 106.68,78.74 107.95,80.01 | D1.A 11.43,17.78 11.43,15.24 | C15.P$3 C15.P$2 | C15.P$2 106.68,74.93 | J1.1 11.43,15.24
  pour Top (no thermals): 90.17,15.24 90.17,12.7 88.9,11.43 99.06,11.43 100.33,12.7 100.33,15.24
  pour Bottom (isolate 0.813, no thermals): 6.35,11.43 96.52,11.43 97.79,13.97 97.79,17.78 95.25,20.32 68.58,20.32 31.75,57.15 7.62,57.15 6.35,55.88
  pour Bottom (no thermals): 68.58,11.43 69.85,10.16 72.39,10.16 73.66,11.43
N$1
  Bottom 0.406: C2.A02 C1.A2
N$3  (via drill 0.6)
  Top 0.406: IC9.8 v80.01,95.25
  Bottom 0.406: v80.01,95.25 80.01,88.9 81.28,87.63 IC9.4
N$4
  Bottom 0.406: R7.1 SW1.5
N$5  (via drill 0.6)
  Top 0.406: v31.75,80.01 40.64,80.01 43.18,82.55 IC3.13
  Bottom 0.406: v31.75,80.01 R4.1 SW1.8
N$6
  Bottom 0.406: R8.1 SW1.6
N$7
  Bottom 0.406: R9.1 SW1.7
N$8
  Top 0.406: R13.1 12.7,93.98 11.43,92.71 11.43,68.58 6.35,63.5 6.35,59.69 M1.J2-3
N$9
  Top 0.406: IC5.1 127,80.01 128.27,81.28 140.97,81.28 142.24,82.55 IC4.7
N$10
  Top 0.305: 114.3,85.09 115.57,86.36 119.38,86.36 120.65,87.63 120.65,88.9 119.38,90.17 IC5.10
  Top 0.406: IC7.13 104.14,82.55 105.41,83.82 113.03,83.82 114.3,85.09
N$11
  Top 0.406: IC5.3 127,85.09 128.27,86.36 140.97,86.36 143.51,88.9 146.05,88.9 147.32,87.63 147.32,86.36 146.05,85.09 IC4.8
N$12
  Top 0.406: IC5.5 IC4.15
N$13  (via drill 0.6)
  Top 0.406: IC2.9 59.69,92.71 58.42,93.98 45.72,93.98 IC3.9 v27.94,92.71
  Bottom 0.406: v27.94,92.71 27.94,81.28 29.21,80.01 R9.2 29.21,72.39 30.48,71.12 34.29,71.12 39.37,66.04 R3.1
N$14
  Top 0.406: R14.1 13.97,90.17 12.7,88.9 12.7,68.58 7.62,63.5 M1.J2-4
N$15
  Top 0.406: IC9.12 IC9.3
  Bottom 0.406: IC9.12 IC9.13
N$16
  Top 0.406: IC5.2 127,82.55 128.27,83.82 140.97,83.82 142.24,85.09 142.24,86.36 143.51,87.63 IC4.9
N$17
  Top 0.406: IC5.4 127,87.63 128.27,88.9 140.97,88.9 142.24,90.17 142.24,91.44 143.51,92.71 IC4.11
N$18
  Top 0.406: IC5.13 119.38,83.82 121.92,83.82 123.19,85.09 123.19,90.17 124.46,91.44 127,91.44 128.27,92.71 IC4.14
N$19  (via drill 0.6)
  Top 0.406: IC8.2 96.52,82.55 97.79,83.82 104.14,83.82 106.68,86.36 v113.03,86.36
  Bottom 0.406: v113.03,86.36 113.03,81.28 111.76,80.01 IC7.1
N$20  (via drill 0.6)
  Top 0.406: IC7.8 101.6,93.98 v72.39,93.98
  Bottom 0.406: v72.39,93.98 72.39,90.17 IC9.11
N$21
  Top 0.406: C1.B5 135.89,7.62 134.62,8.89 134.62,11.43 135.89,12.7 C2.B05
N$22
  Top 1.016: K1.1 29.21,17.78 27.94,19.05 R12.1 20.32,25.4 17.78,22.86 16.51,22.86 D1.C
N$24
  Bottom 0.406: IC8.5 IC8.4 IC8.3
N$25  (via drill 0.6)
  Top 0.406: v92.71,91.44 107.95,91.44 109.22,92.71 IC7.6
  Bottom 0.406: v92.71,91.44 88.9,95.25 IC8.8
N$27
  Top 0.406: R15.1 15.24,86.36 13.97,85.09 13.97,68.58 8.89,63.5 8.89,59.69 M1.J2-5
N$28
  Top 0.406: R16.1 24.13,71.12 24.13,57.15 21.59,54.61 16.51,54.61 M1.J2-7
N$29
  Top 0.406: R17.1 16.51,74.93 16.51,67.31 12.7,63.5 M1.J2-8
N$30
  Top 0.406: M1.J2-9 17.78,55.88 20.32,55.88 21.59,57.15 21.59,69.85 R18.1
N$31
  Top 0.406: R19.1 16.51,82.55 15.24,81.28 15.24,68.58 10.16,63.5 M1.J2-6
N$32
  Top 0.406: R13.2 LED1.K
N$33
  Top 0.406: R14.2 LED2.K
N$34
  Top 0.406: R15.2 LED3.K
N$35
  Top 0.406: R16.2 LED4.K
N$36
  Top 0.406: R17.2 LED5.K
N$37
  Top 0.406: R18.2 LED6.K
N$38
  Top 0.406: R19.2 LED7.K
N$39  (via drill 0.6)
  Top 0.406: IC5.11 115.57,87.63 114.3,88.9 101.6,88.9 100.33,90.17 97.79,90.17 96.52,88.9 73.66,88.9 72.39,87.63 IC2.4 67.31,87.63 64.77,90.17 IC2.10 54.61,90.17 53.34,91.44 48.26,91.44 45.72,88.9 v22.86,88.9
  Bottom 0.406: IC2.4 IC2.3 | v22.86,88.9 22.86,69.85 21.59,68.58 R10.1
N$41  (via drill 0.6)
  Top 0.305: 57.15,88.9 53.34,88.9 IC3.4
  Top 0.406: v38.1,87.63 IC3.11 IC3.4 | 57.15,88.9 64.77,88.9 66.04,87.63 66.04,85.09 67.31,83.82 86.36,83.82 IC8.13
  Bottom 0.406: v38.1,87.63 38.1,69.85 39.37,68.58 R11.1 | IC3.10 IC3.11 | IC3.4 IC3.3 | IC8.12 IC8.13
N$44  (via drill 0.6)
  Top 0.406: v36.83,76.2 v44.45,76.2 | v54.61,76.2 100.33,76.2 101.6,74.93 109.22,74.93 110.49,76.2 116.84,76.2 118.11,74.93 v119.38,74.93
  Bottom 0.406: SW2.3 R5.1 v36.83,76.2 | v44.45,76.2 v54.61,76.2 | v119.38,74.93 125.73,74.93 128.27,77.47 IC4.20
N$46  (via drill 0.6)
  Top 1.016: D2.C 16.51,26.67 R12.2 20.32,27.94 v33.02,27.94 | v40.64,27.94 40.64,20.32 K1.6
  Bottom 1.016: v33.02,27.94 v40.64,27.94
N$47
  Bottom 1.016: D2.A 2.54,24.13 2.54,19.05 3.81,17.78 3.81,15.24 J1.3
N$49
  Top 1.016: C1.B33 C2.A33
  Bottom 1.016: C2.A33 C2.B33 | C1.B33 C2.A33 | C2.A33 6.35,10.16 J1.2
N$50
  Top 0.406: JP1.2 60.96,59.69 IC11.22
N$51
  Top 0.406: IC11.31 JP2.2
N$52
  Bottom 0.406: C1.A19 C2.A19
N$55
  Bottom 0.406: C1.A21 C2.A21
N$56
  Bottom 0.406: C1.A22 C2.A22
N$57
  Bottom 0.406: C1.A23 C2.A23
N$58
  Top 0.406: C1.B29 74.93,7.62 73.66,8.89 73.66,11.43 74.93,12.7 C2.B29
N$59
  Bottom 0.406: C1.A24 C2.A24
N$60
  Top 0.406: C1.B24 87.63,7.62 86.36,8.89 86.36,13.97 C2.B24
N$61
  Bottom 0.406: C1.A25 C2.A25
N$62
  Top 0.406: C1.B25 85.09,7.62 83.82,8.89 83.82,13.97 C2.B25
N$63
  Bottom 0.406: C1.A26 C2.A26
N$64
  Bottom 0.406: C1.A32 C2.A32
N$65
  Top 0.406: C1.B30 72.39,7.62 71.12,8.89 71.12,11.43 72.39,12.7 C2.B30
N$66
  Bottom 0.406: 146.05,7.62 C1.A1 C2.A01
N$67
  Top 0.406: C1.B1 146.05,7.62 144.78,8.89 144.78,11.43 146.05,12.7 C2.B01
N$68
  Top 1.016: 45.72,10.16 39.37,10.16 38.1,11.43 IC6.IN2 K1.4 | IC6.IN1 45.72,10.16 | C3.1 50.8,10.16 45.72,10.16
N$69
  Top 1.016: C1.B4 C2.A04 C2.B04 129.54,24.13 58.42,24.13 54.61,27.94 50.8,27.94 K1.9
  Bottom 0.406: C1.B4 138.43,7.62
  Bottom 1.016: C1.B4 C2.A04
N$70
  Top 1.016: IC6.OUT2 40.64,13.97 41.91,15.24 45.72,15.24 | IC6.OUT1 48.26,13.97 46.99,15.24 45.72,15.24 | K1.11 45.72,22.86 | 45.72,22.86 45.72,15.24 | C4.1 50.8,22.86 45.72,22.86
N$71  (via drill 0.6)
  Top 0.406: v25.4,80.01 26.67,81.28 40.64,81.28 43.18,83.82 55.88,83.82 57.15,85.09 59.69,85.09 IC2.13
  Bottom 0.406: v25.4,80.01 M1.J2-18
PAGE_DECODE  (via drill 0.6)
  Top 0.406: IC7.4 105.41,87.63 104.14,86.36 100.33,86.36 | 100.33,86.36 v83.82,86.36 v73.66,86.36 | TP11.P$1 100.33,86.36
  Bottom 0.406: IC9.9 IC9.10 76.2,90.17 77.47,88.9 77.47,87.63 76.2,86.36 v73.66,86.36 | v83.82,86.36 81.28,86.36 80.01,85.09 80.01,83.82 81.28,82.55 IC9.2
RAM_DECODE  (via drill 0.6)
  Top 0.406: IC5.6 123.19,92.71 121.92,91.44 v114.3,91.44 | IC7.9 105.41,92.71 v106.68,93.98
  Bottom 0.305: IC7.3 109.22,85.09 107.95,86.36 107.95,92.71 v106.68,93.98
  Bottom 0.406: IC7.9 TP8.P$1 | v106.68,93.98 111.76,93.98 v114.3,91.44
ROM_DECODE  (via drill 0.6)
  Top 0.406: TP7.P$1 86.36,81.28 104.14,81.28 105.41,82.55 IC7.2 113.03,82.55 114.3,83.82 116.84,83.82 IC5.12 | v80.01,35.56 97.79,35.56 99.06,36.83 IC12.2
  Bottom 0.406: IC9.5 83.82,90.17 85.09,88.9 TP7.P$1 IC9.1 83.82,78.74 83.82,76.2 80.01,72.39 v80.01,35.56
SA1  (via drill 0.6)
  Top 0.406: IC2.6 67.31,92.71 66.04,91.44 54.61,91.44 53.34,92.71 IC3.6 48.26,92.71 46.99,91.44 v34.29,91.44 v25.4,91.44
  Bottom 0.406: R2.1 v34.29,91.44 | v25.4,91.44 25.4,82.55 26.67,81.28 R8.2
SA2
  Top 0.406: IC2.2 67.31,82.55 66.04,81.28 60.96,81.28 59.69,82.55 IC3.2 48.26,82.55 46.99,81.28 43.18,81.28 40.64,78.74 33.02,78.74 30.48,76.2 25.4,76.2 24.13,74.93 R7.2
  Bottom 0.406: R1.1 22.86,66.04 24.13,67.31 R7.2
VCC
  Top 0.305: 31.75,69.85 R11.2
  Top 0.406: R2.2 R6.2 R5.2 R2.2 | R2.2 R4.2 | JP1.3 55.88,59.69 | JP2.3 55.88,43.18 | 31.75,69.85 R4.2 | R11.2 R10.2 R1.2 R3.2 | IC3.14 41.91,77.47 33.02,77.47 31.75,76.2 R4.2
  Top 0.813: C15.P$1 106.68,80.01 IC7.14
  Top 1.016: 87.63,77.47 C11.P$1 78.74,80.01 IC9.14 72.39,77.47 62.23,77.47 | 87.63,77.47 100.33,77.47 IC7.14 | IC1.20 146.05,43.18 147.32,44.45 C16.P$1 C14.P$1 143.51,64.77 142.24,66.04 130.81,66.04 IC4.24 C12.P$1 118.11,78.74 | 62.23,77.47 IC2.14 59.69,80.01 C10.P$1 | IC8.14 87.63,77.47 | IC5.14 118.11,78.74 | 52.07,76.2 52.07,72.39 55.88,68.58 55.88,59.69 55.88,43.18 54.61,41.91 54.61,36.83 | 52.07,76.2 54.61,78.74 55.88,78.74 57.15,77.47 62.23,77.47 | IC10.IN2 15.24,11.43 16.51,10.16 22.86,10.16 | IC10.IN1 22.86,10.16 | 22.86,10.16 26.67,10.16 C6.1 35.56,19.05 35.56,22.86 K1.13 38.1,27.94 41.91,31.75 54.61,31.75 | 54.61,31.75 C13.P$1 60.96,33.02 IC11.32 67.31,34.29 69.85,31.75 85.09,31.75 | C5.+ 54.61,36.83 | 54.61,36.83 54.61,35.56 | 54.61,35.56 54.61,31.75 | IC3.14 48.26,80.01 C9.P$1 52.07,76.2 | 118.11,78.74 116.84,77.47 C15.P$1 | TP1.P$1 54.61,35.56 | C17.P$1 85.09,31.75 | 85.09,31.75 IC12.32
  Bottom 0.406: IC2.12 60.96,85.09 59.69,83.82 59.69,81.28 60.96,80.01 IC2.14 | IC12.32 86.36,34.29 87.63,35.56 87.63,38.1 86.36,39.37 IC12.30

## Text on the board
Top: TOP
Bottom: BOT
tValues: EPNET | EXP | EP64 | rev 1.0 | B. Tanner 2015 | DIS | ENA | DIS | ENA | +9V | GND | NC | VSYNC | 14MHz | A20 | A18 | A16 | EC3 | EC1 | GND | GND | GND | GND | GND | !INT! | D7 | D5 | D3 | D1 | A7 | A5 | A3 | A1 | A15 | A13 | A11 | A9 | !NMI! | +5V | !IORQ! | !WR! | L | +9V | HSYN | GND | GND | A21 | A19 | A17 | !EXTC! | EC2 | EC0 | 8MHz | CLK | 1MHz | !M1! | !WAIT! | !RES! | D6 | D4 | D2 | D0 | A6 | A4 | A2 | A0 | A14 | A12 | A10 | A8 | !MREQ! | +5V | !RD! | !RFSH! | R